# Altium project PicoBOB.PrjPCB
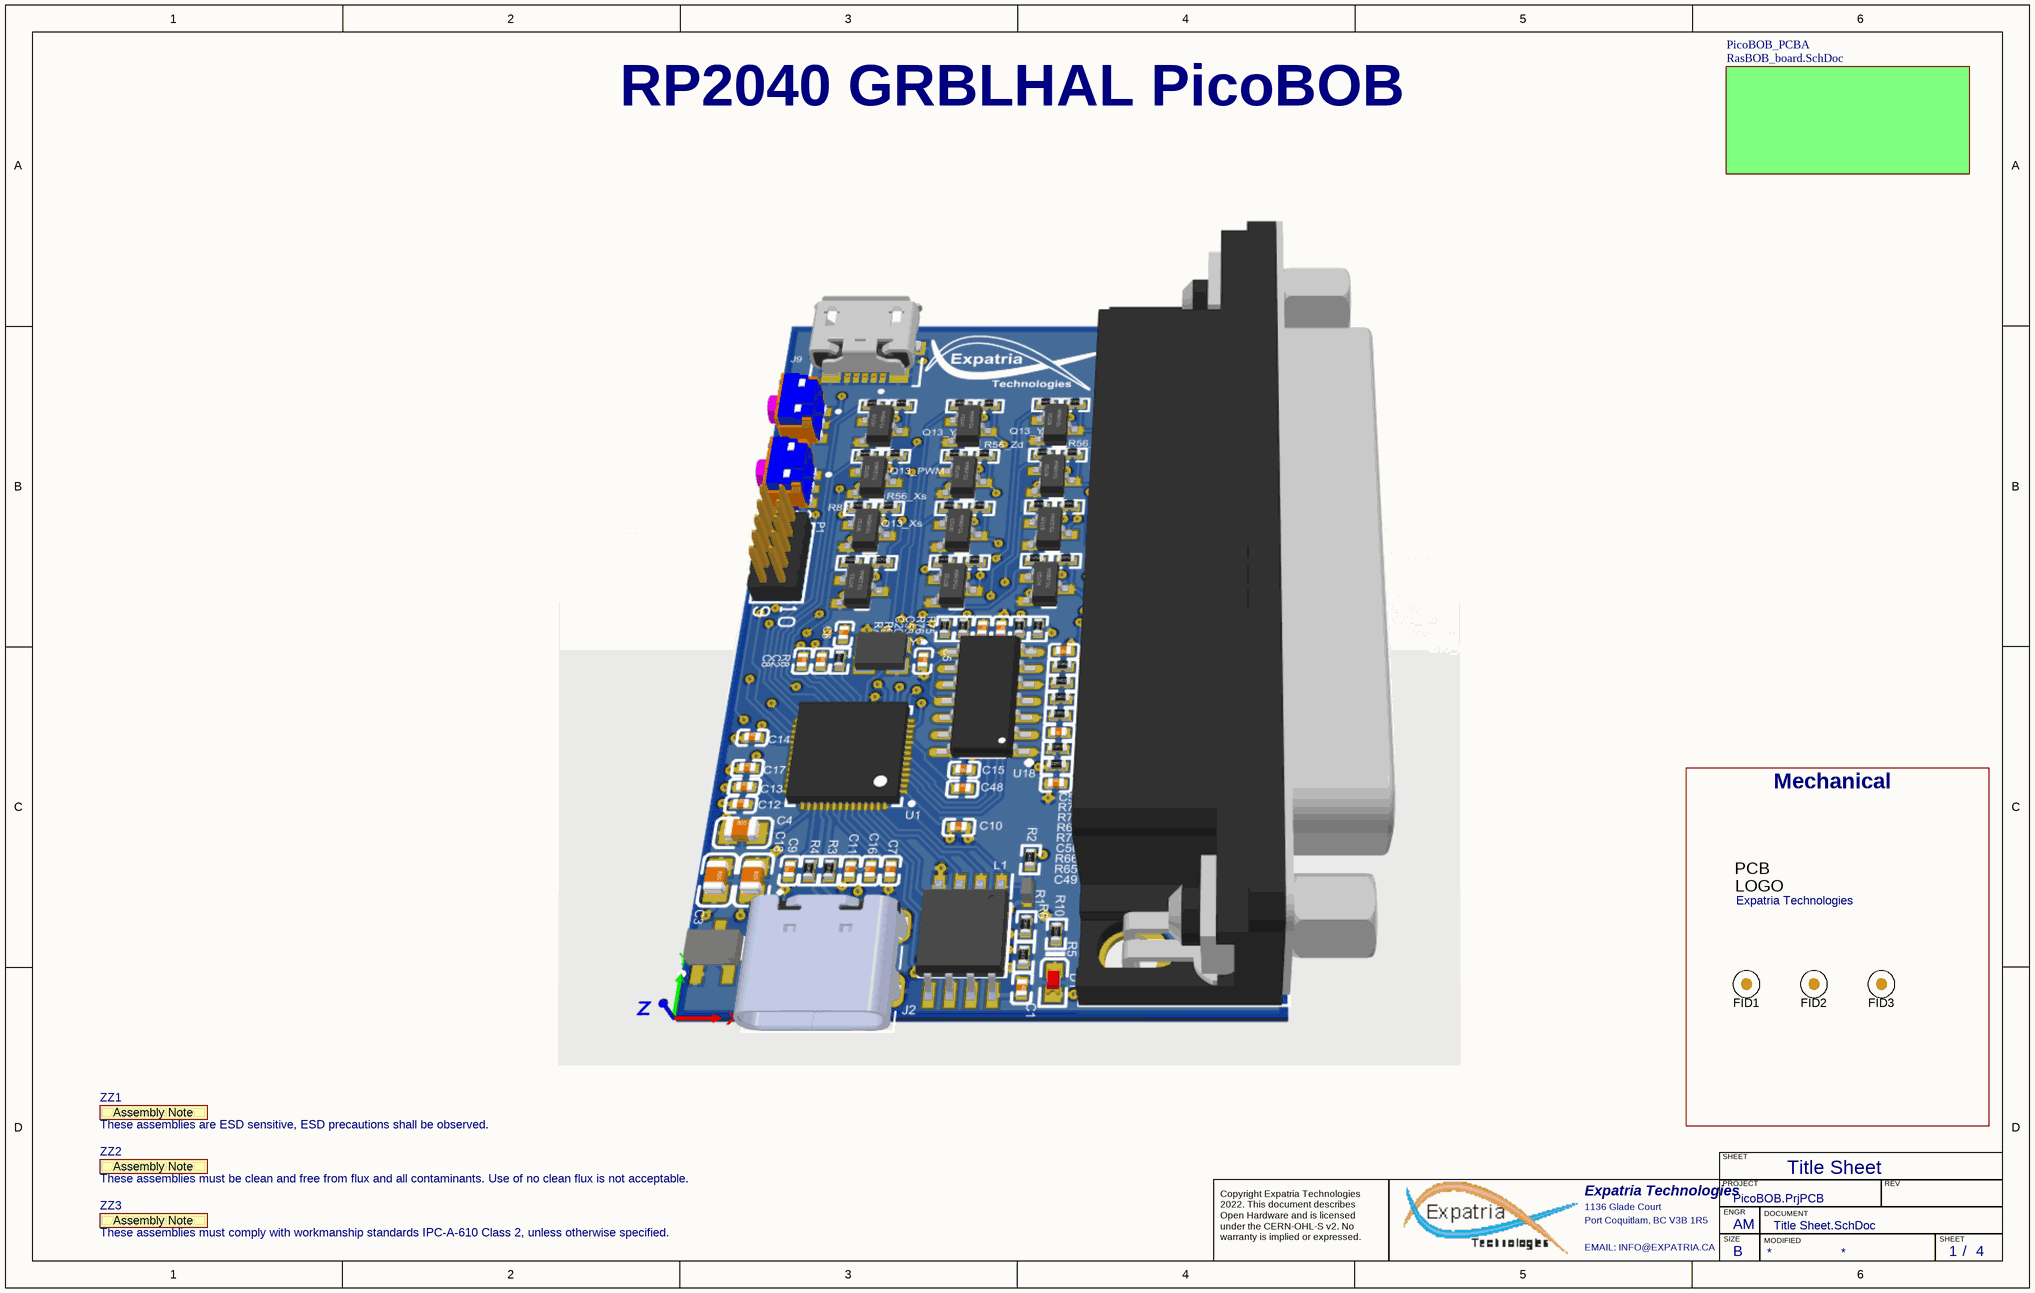
[diagram p0: Title Sheet.SchDoc]
VarRevNo: B2; Title: PicoBOB; PCBREVNO: B2; PCBPARTNO: PicoBOB
4 sheets, 97 parts. Net scope: hierarchical (ports join the sheet entries above them; power ports are global).
Board file: RasBOB_board.pcbdoc
Sheets:
  Title Sheet.SchDoc
    PicoBOB_PCBA = RasBOB_board.SchDoc
      PWM = 5V_Output_shift.SchDoc
      EN = 5V_Output_shift.SchDoc
      Xs = 5V_Output_shift.SchDoc
      Xd = 5V_Output_shift.SchDoc
      Ys = 5V_Output_shift.SchDoc
      Yd = 5V_Output_shift.SchDoc
      Zs = 5V_Output_shift.SchDoc
      Zd = 5V_Output_shift.SchDoc
      As = 5V_Output_shift.SchDoc
      Ad = 5V_Output_shift.SchDoc
      Bs = 5V_Output_shift.SchDoc
      Bd = 5V_Output_shift.SchDoc
      MCU = RP2040_MCU.SchDoc

## Sheet Title Sheet.SchDoc: RP2040 CNC
size B; Author: AM; CompanyName: Expatria Technologies; DrawnBy: A.Marles; Engineer: AM; Organization: Expatria Technolgoies; Address1: Schematic; DocumentNumber: 1; Revision: B2; SheetNumber: 1; SheetTotal: 4

### Parts
FID1  Fiducial  [Fiducial10-20]  (value not drawn)  (no BOM)
FID2  Fiducial  [Fiducial10-20]  (value not drawn)  (no BOM)
FID3  Fiducial  [Fiducial10-20]  (value not drawn)  (no BOM)
Logo1  Expatria Technologies  [Expatria-Logo]  (no BOM)
ZZ1  These assemblies are ESD sensitive, ESD precautions shall be observed.  [AssemblyNote]  (graphical)
ZZ2  These assemblies must be clean and free from flux and all contaminants. Use of no clean flux is not acceptable.  [AssemblyNote]  (graphical)
ZZ3  These assemblies must comply with workmanship standards IPC-A-610 Class 2, unless otherwise specified.  [AssemblyNote]  (graphical)

### Blocks framed on the sheet
Mechanical: FID1-FID3 Logo1

### Sub-sheets
PicoBOB_PCBA = RasBOB_board.SchDoc: no entries

### Notes on the sheet
- RP2040 GRBLHAL PicoBOB
- Title Sheet
- SHEET
- Expatria Technologies
- 1136 Glade Court
- Port Coquitlam, BC V3B 1R5
- PROJECT
- SIZE
- ENGR
- MODIFIED
- DOCUMENT
- REV
- Copyright Expatria Technologies 2022. This document describes Open Hardware and is licensed under the CERN-OHL-S v2. No warranty is implied or expressed.
- EMAIL: INFO@EXPATRIA.CA
- B
- /
- (in symbol AssemblyNote) Assembly Note
- (in symbol SBT-Logo) PCB; LOGO

### Library data of the parts
FID1-FID3 = Fiducial: FIDUCIAL NO ASSEMBLY; Manufacturer 1: NONE; Manufacturer Part Number 1: NONE; Value: Fiducial
Logo1 = SBT-Logo: Manufacturer 1: NONE; Value: Expatria Logo; Manufacturer Part Number 1: NONE
ZZ1-ZZ3 = AssemblyNote: SymbolCreator: codlsc; SymbolVersion: 2010-05-18; CompType: AssemblyNote; ClassName: AssemblyNote; Publisher: Texas Instruments; LatestRevisionDate: 2012-06-14; LatestRevisionNote: Initial Version; Alternate Manufacturer: -; Alternate PartNumber: -

## Sheet RasBOB_board.SchDoc: RP2040 CNC
size C; Author: AM; CompanyName: Expatria Technologies; DrawnBy: A.Marles; Engineer: AM; Organization: Expatria Technolgoies; Address1: Schematic; DocumentNumber: 2; Revision: B2; SheetNumber: 2; SheetTotal: 4
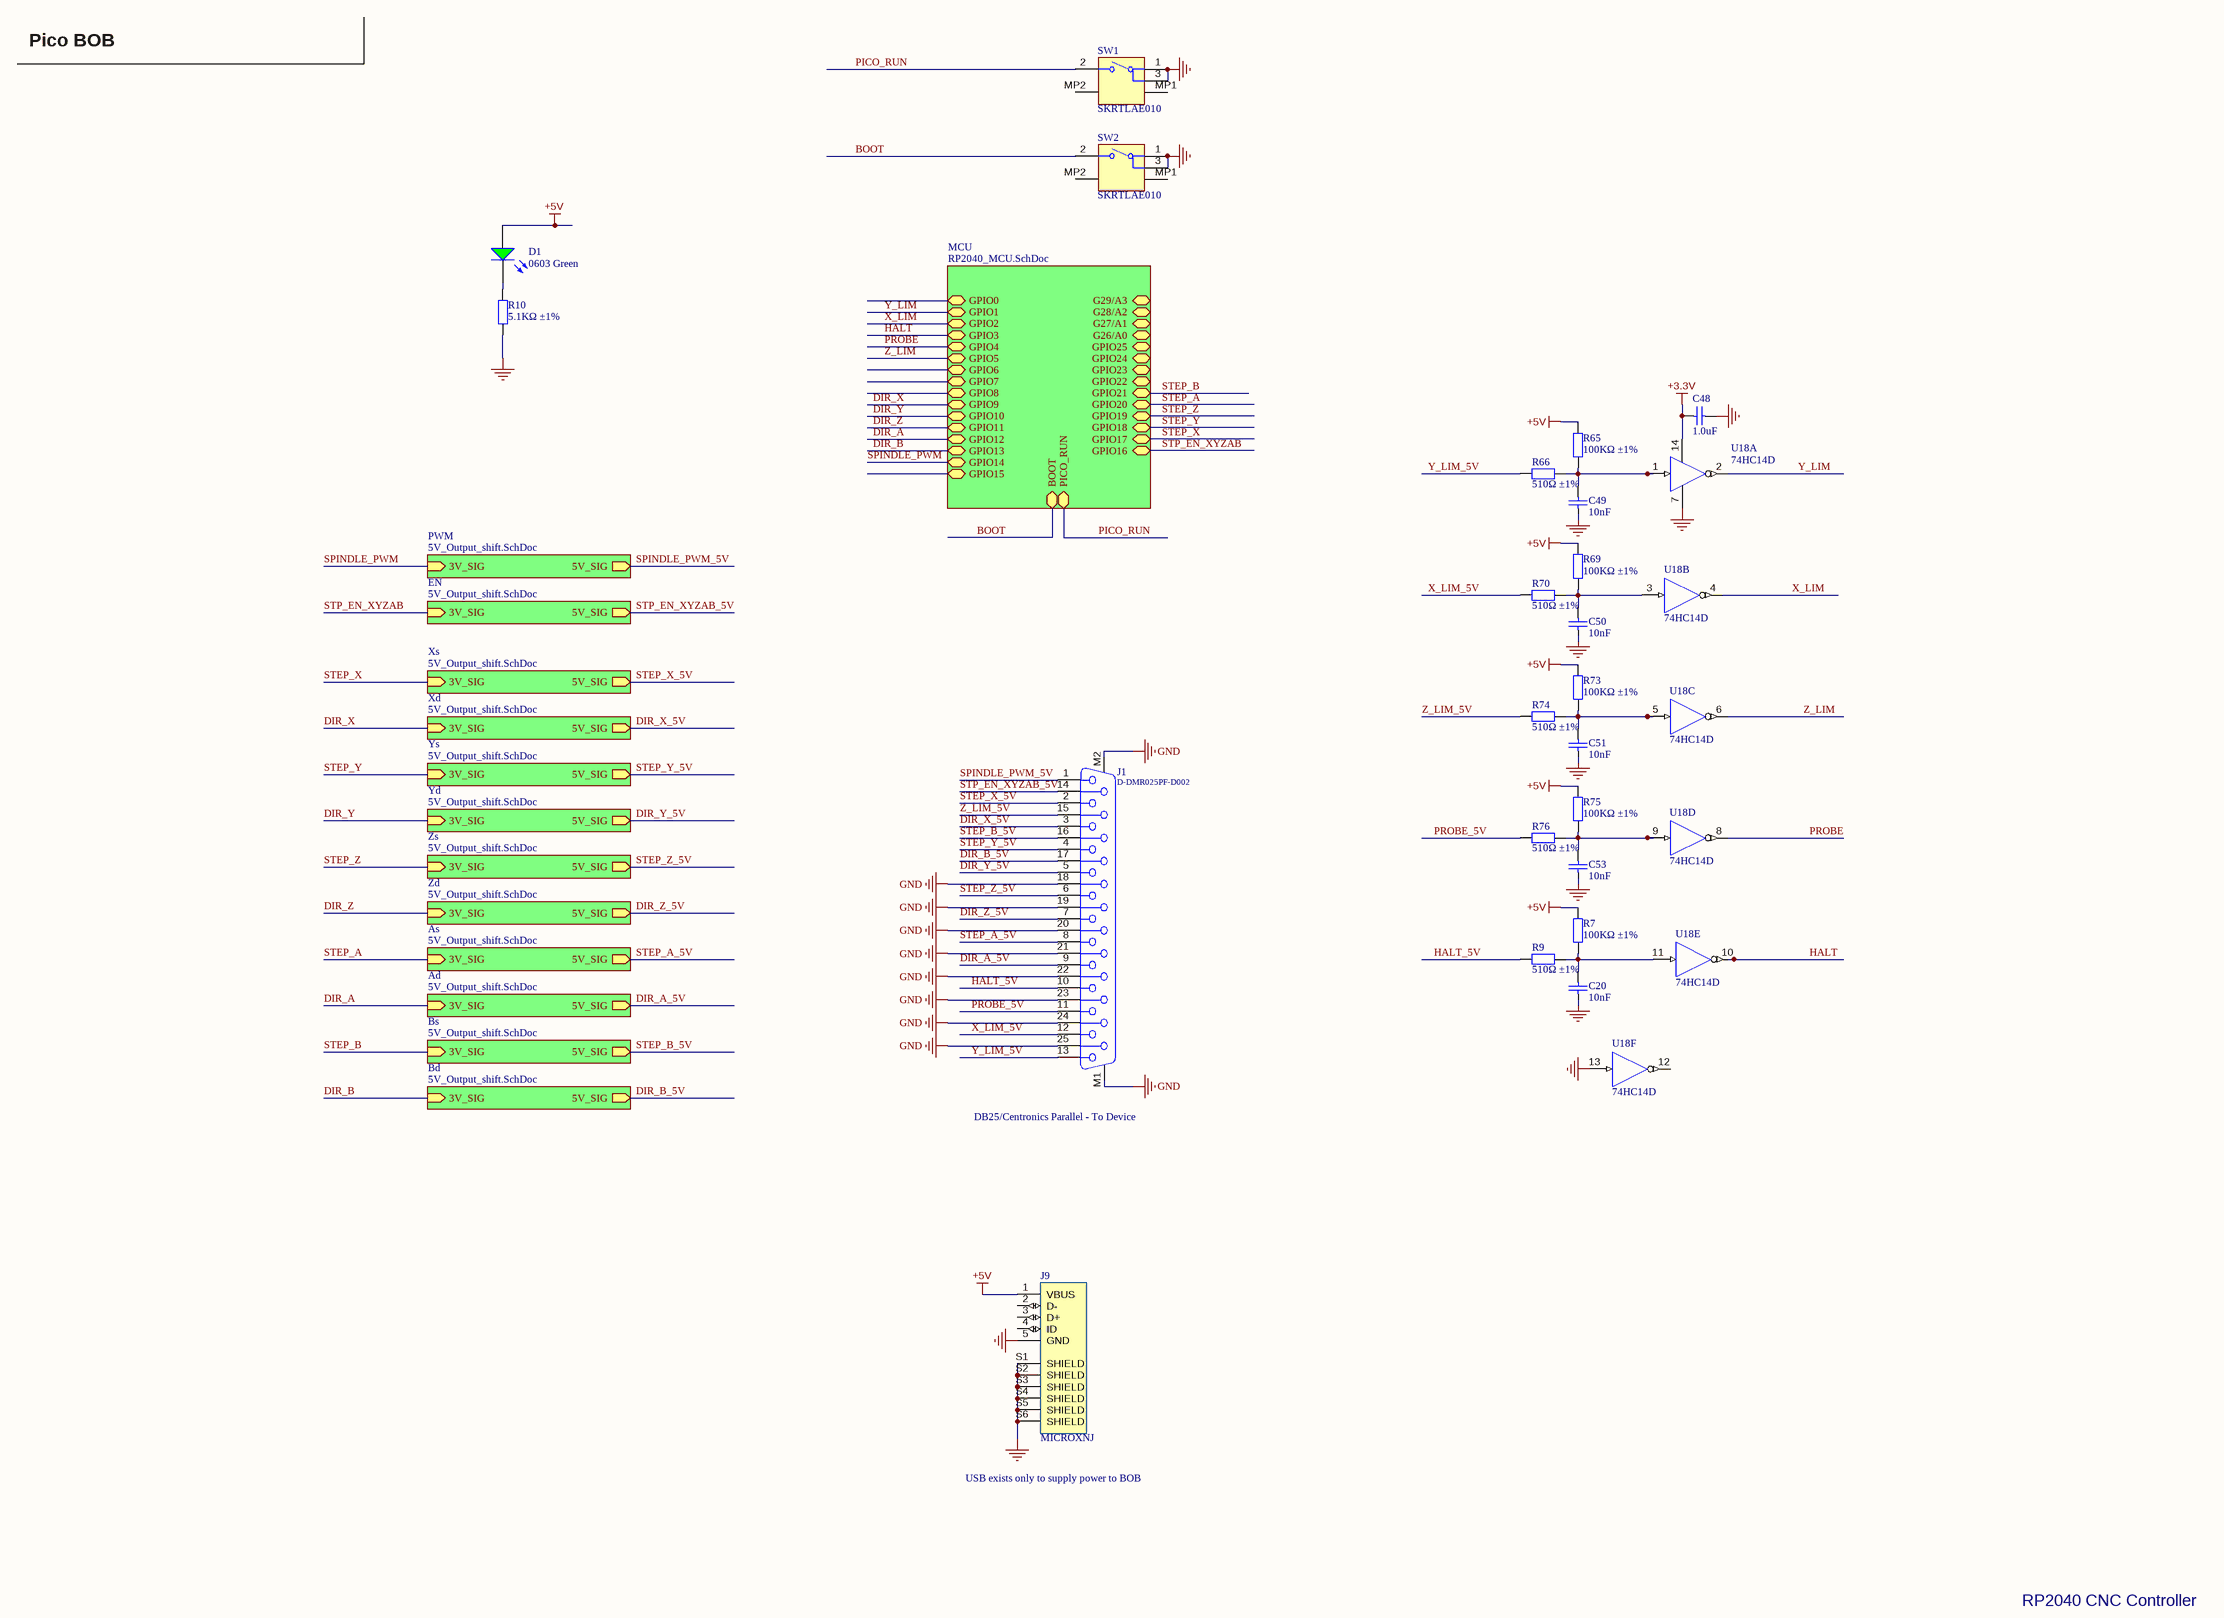
[diagram p1: RasBOB_board.SchDoc]

### Parts
C20  10nF  [0402_C]
C48  1.0uF  [0402_C]
C49  10nF  [0402_C]
C50  10nF  [0402_C]
C51  10nF  [0402_C]
C53  10nF  [0402_C]
D1  0603 Green  [0603_LED_S1]
J1  D-DMR025PF-D002  [618025231121]
J9  MICROXNJ  [SHOUHAN_MICROXNJ]
R7  100KΩ ±1%  [0402_R]
R9  510Ω ±1%  [0402_R]
R10  5.1KΩ ±1%  [0402_R]
R65  100KΩ ±1%  [0402_R]
R66  510Ω ±1%  [0402_R]
R69  100KΩ ±1%  [0402_R]
R70  510Ω ±1%  [0402_R]
R73  100KΩ ±1%  [0402_R]
R74  510Ω ±1%  [0402_R]
R75  100KΩ ±1%  [0402_R]
R76  510Ω ±1%  [0402_R]
SW1  SKRTLAE010  [ALPS-SKRTLAE010_V]
SW2  SKRTLAE010  [ALPS-SKRTLAE010_V]
U18  74HC14D  [SOIC-14_150mil]  (parts A,B,C,D,E,F of 6)

### Sub-sheets
Ad = 5V_Output_shift.SchDoc: 3V_SIG (in), 5V_SIG (out)
As = 5V_Output_shift.SchDoc: 3V_SIG (in), 5V_SIG (out)
Bd = 5V_Output_shift.SchDoc: 3V_SIG (in), 5V_SIG (out)
Bs = 5V_Output_shift.SchDoc: 3V_SIG (in), 5V_SIG (out)
EN = 5V_Output_shift.SchDoc: 3V_SIG (in), 5V_SIG (out)
MCU = RP2040_MCU.SchDoc: G28/A2 (bidir), GPIO20 (bidir), GPIO14 (bidir), GPIO25 (bidir), GPIO15 (bidir), GPIO8 (bidir), GPIO1 (bidir), G27/A1 (bidir), GPIO0 (bidir), GPIO13 (bidir), G26/A0 (bidir), GPIO21 (bidir), PICO_RUN (bidir), G29/A3 (bidir), GPIO7 (bidir), GPIO6 (bidir), GPIO12 (bidir), GPIO2 (bidir), GPIO4 (bidir), GPIO17 (bidir), GPIO10 (bidir), GPIO11 (bidir), GPIO23 (bidir), GPIO22 (bidir), GPIO18 (bidir), GPIO5 (bidir), GPIO9 (bidir), GPIO3 (bidir), GPIO24 (bidir), GPIO19 (bidir), GPIO16 (bidir), BOOT (bidir)
PWM = 5V_Output_shift.SchDoc: 3V_SIG (in), 5V_SIG (out)
Xd = 5V_Output_shift.SchDoc: 3V_SIG (in), 5V_SIG (out)
Xs = 5V_Output_shift.SchDoc: 3V_SIG (in), 5V_SIG (out)
Yd = 5V_Output_shift.SchDoc: 3V_SIG (in), 5V_SIG (out)
Ys = 5V_Output_shift.SchDoc: 3V_SIG (in), 5V_SIG (out)
Zd = 5V_Output_shift.SchDoc: 3V_SIG (in), 5V_SIG (out)
Zs = 5V_Output_shift.SchDoc: 3V_SIG (in), 5V_SIG (out)

### Nets
+3.3V: C48.1 U18.14(VDD)
+5V: D1.A J9.1(VBUS) R7.2 R65.2 R69.2 R73.2 R75.2
GND: C20.1 C48.2 C49.1 C50.1 C51.1 C53.1 J1.18 J1.19 J1.20 J1.21 J1.22 J1.23 J1.24 J1.25 J1.M1 J1.M2 J9.5(GND) J9.S1(SHIELD) J9.S2(SHIELD) J9.S3(SHIELD) J9.S4(SHIELD) J9.S5(SHIELD) J9.S6(SHIELD) R10.2 SW1.1 SW1.3 SW2.1 SW2.3 U18.7(GND) U18.13(A)
BOOT: SW2.2 ; sheet MCU/BOOT
DIR_A: sheet Ad/3V_SIG, sheet MCU/GPIO12
DIR_A_5V: J1.9 ; sheet Ad/5V_SIG
DIR_B: sheet Bd/3V_SIG, sheet MCU/GPIO13
DIR_B_5V: J1.17 ; sheet Bd/5V_SIG
DIR_X: sheet Xd/3V_SIG, sheet MCU/GPIO9
DIR_X_5V: J1.3 ; sheet Xd/5V_SIG
DIR_Y: sheet Yd/3V_SIG, sheet MCU/GPIO10
DIR_Y_5V: J1.5 ; sheet Yd/5V_SIG
DIR_Z: sheet Zd/3V_SIG, sheet MCU/GPIO11
DIR_Z_5V: J1.7 ; sheet Zd/5V_SIG
HALT: U18.10(Y) ; sheet MCU/GPIO3
HALT_5V: J1.10 R9.1
PICO_RUN: SW1.2 ; sheet MCU/PICO_RUN
PROBE: U18.8(Y) ; sheet MCU/GPIO4
PROBE_5V: J1.11 R76.1
SPINDLE_PWM: sheet PWM/3V_SIG, sheet MCU/GPIO14
SPINDLE_PWM_5V: J1.1 ; sheet PWM/5V_SIG
STEP_A: sheet As/3V_SIG, sheet MCU/GPIO20
STEP_A_5V: J1.8 ; sheet As/5V_SIG
STEP_B: sheet Bs/3V_SIG, sheet MCU/GPIO21
STEP_B_5V: J1.16 ; sheet Bs/5V_SIG
STEP_X: sheet Xs/3V_SIG, sheet MCU/GPIO17
STEP_X_5V: J1.2 ; sheet Xs/5V_SIG
STEP_Y: sheet Ys/3V_SIG, sheet MCU/GPIO18
STEP_Y_5V: J1.4 ; sheet Ys/5V_SIG
STEP_Z: sheet Zs/3V_SIG, sheet MCU/GPIO19
STEP_Z_5V: J1.6 ; sheet Zs/5V_SIG
STP_EN_XYZAB: sheet EN/3V_SIG, sheet MCU/GPIO16
STP_EN_XYZAB_5V: J1.14 ; sheet EN/5V_SIG
X_LIM: U18.4(Y) ; sheet MCU/GPIO2
X_LIM_5V: J1.12 R70.1
Y_LIM: U18.2(Y) ; sheet MCU/GPIO1
Y_LIM_5V: J1.13 R66.1
Z_LIM: U18.6(Y) ; sheet MCU/GPIO5
Z_LIM_5V: J1.15 R74.1
NetC20_2: C20.2 R7.1 R9.2 U18.11(A)
NetC49_2: C49.2 R65.1 R66.2 U18.1(A)
NetC50_2: C50.2 R69.1 R70.2 U18.3(A)
NetC51_2: C51.2 R73.1 R74.2 U18.5(A)
NetC53_2: C53.2 R75.1 R76.2 U18.9(A)
NetD1_K: D1.K R10.1

Not connected (* = marked no-connect by the designer): J9 2(D-) 3(D+) 4(ID); SW1 MP1 MP2; SW2 MP1 MP2; U18 12(Y)

### Notes on the sheet
- Pico BOB
- DB25/Centronics Parallel - To Device
- USB exists only to supply power to BOB
- RP2040 CNC Controller
- Expatria Technologies
- SHEET
- PROJECT
- REV
- 1136 Glade Court
- Port Coquitlam, BC V3B 1R5
- EMAIL: INFO@EXPATRIA.CA
- SIZE
- ENGR
- C
- MODIFIED
- DOCUMENT
- /
- Copyright Expatria Technologies 2022. This document describes Open Hardware and is licensed under the CERN-OHL-S v2. No warranty is implied or expressed.

### Library data of the parts
C20 C49-C51 C53 = 0402 10nF (103) 10% 50V: Chip capacitors; Manufacturer: Samsung Electro-Mechanics; PartNumber: CL05B103KB5NNNC; Tolerance: 10%; Voltage: 50V; ComponentLink1Description: Supplier link; ComponentLink1URL: http://www.szlcsc.com/product/details_15869.html; Package: 0402; Supplier: LC; SuppliersPartNumber: C15195; Capacitance: 10nF
C48 = 0402 1.0uF (105) 10% 25V: Chip capacitor; Manufacturer: Samsung Electro-Mechanics; PartNumber: CL05A105KA5NQNC; Capacitance: 1uF; Tolerance: 10%; Voltage: 25V; ComponentLink1Description: Supplier link; ComponentLink1URL: http://www.szlcsc.com/product/details_53938.html; Package: 0402; Supplier: LC; SuppliersPartNumber: C52923
D1 = 0603 LED Green: LED; ComponentLink1Description: 供应商链接; ComponentLink1URL: http://www.szlcsc.com/product/details_73152.html; Package: 0603; Supplier: LC; SuppliersPartNumber: C72043; Color: Green
J1 = CMP-1502-00202-1: Through Hole,P=2.77mm D-Sub Connectors ROHS; SuppliersPartNumber: C190083; PartNumber: D-DMR025PF-D002
J9 = MICROXNJ: Micro USB; MF: Shouhan; Package: Package; SuppliersPartNumber: C404969; Check_prices: https://www.snapeda.com/parts/MICROXNJ/Shouhan/view-part/5703693/?ref=eda; Price: None; SnapEDA_Link: https://www.snapeda.com/parts/MICROXNJ/Shouhan/view-part/5703693/?ref=snap; Availability: Unavailable; MP: MICROXNJ; Value: *
R7 R65 R69 R73 R75 = 0402 100K (1003) 1%: Chip resistor; Manufacturer: Uniroyal Elec; PartNumber: 0402WGF1003TCE; Power: 1/16W; ComponentLink1Description: Supplier link; ComponentLink1URL: http://www.szlcsc.com/product/details_26484.html; Package: 0402; Supplier: LC; SuppliersPartNumber: C25741; Resistance: 100KΩ; Tolerance: 1%
R9 R66 R70 R74 R76 = 0402 510R (5100) 1%: Chip resistor; Manufacturer: Uniroyal Elec; PartNumber: 0402WGF5100TCE; Power: 1/16W; ComponentLink1Description: Supplier link; ComponentLink1URL: http://www.szlcsc.com/product/details_25866.html; Package: 0402; Supplier: LC; SuppliersPartNumber: C25123; Resistance: 510Ω; Tolerance: 1%
R10 = 0402 5.1K (5101) 1%: Chip resistor; Manufacturer: Uniroyal Elec; PartNumber: 0402WGF5101TCE; Power: 1/16W; Resistance: 51.1KΩ; ComponentLink1Description: Supplier link; ComponentLink1URL: http://www.szlcsc.com/product/details_26648.html; Package: 0402; Supplier: LC; SuppliersPartNumber: C25905; Tolerance: 1%
SW1 SW2 = CMP-2000-07073-2: Side Push Type, 250 V, -40 to 90 degC, 3-Pin SMD, RoHS, Tape and Reel; Manufacturer: ALPS; Operating Force: 1.6N; Folder: Unified Components\Components\New Releases\New\; Maximum Current Rating: 0.05@12VDCA; RevisionId: 1; Pole Throw Configuration: SPST; Switch Configuration: N.O.; AccessRights: 2147483647; Maximum DC Voltage Rating: 12V; ContentType: Unified Component; Rad Hard: No; Mounting: SurfaceMount; Datasheet URL: http://www.alps.com/prod/info/E/PDF/Tact/SurfaceMount/SKRT/SKRT.PDF; Manufacturer URL: http://www.alps.com/e/; ReleaseDate: 22/09/2017 06:13:25 AM; ItemHRID: CMP-2000-07073; ContentTypeGUID: CB3C11C4-E317-11DF-B822-12313F0024A2; LifeCycle: Released; ItemGUID: EAC55BEC-37DC-4BDB-8BA7-D75E6D5C3D75; Packaging: Tape&Reel; Package Reference: SKRTLAE010; FolderGUID: B7F4506A-9127-42E7-A087-46FE7B18D116; Datasheet Version: 06/2015; Mounting Technology: SurfaceMount; LifeCycleStateGUID: 61E382EE-6656-4F12-9E24-BE9327104A25; Package Description: 3-Pin Surface Mount Device, Body 4.5 x 3.55 mm, Pitch 1.225 mm; SuppliersPartNumber: C110293; Manufacturer 1: ALPS
U18 = 74HC14D_[C5605]: 74系列逻辑芯片; ComponentLink1Description: 供应商链接; ComponentLink1URL: http://www.szlcsc.com/product/details_6056.html; Package: SOIC-14_150mil; Supplier: LC; SuppliersPartNumber: C5605

## Sheet 5V_Output_shift.SchDoc: RP2040 CNC
size B; Author: AM; CompanyName: Expatria Technologies; DrawnBy: A.Marles; Engineer: AM; Organization: Expatria Technolgoies; DocumentNumber: 4; Revision: B2; SheetNumber: 4; SheetTotal: 4
Used 12 times, as channels PicoBOB_PCBA/PWM, PicoBOB_PCBA/EN, PicoBOB_PCBA/Xs, PicoBOB_PCBA/Xd, PicoBOB_PCBA/Ys, PicoBOB_PCBA/Yd, PicoBOB_PCBA/Zs, PicoBOB_PCBA/Zd, PicoBOB_PCBA/As, PicoBOB_PCBA/Ad, PicoBOB_PCBA/Bs, PicoBOB_PCBA/Bd. Parts and nets are listed once, with the designators drawn on the sheet.
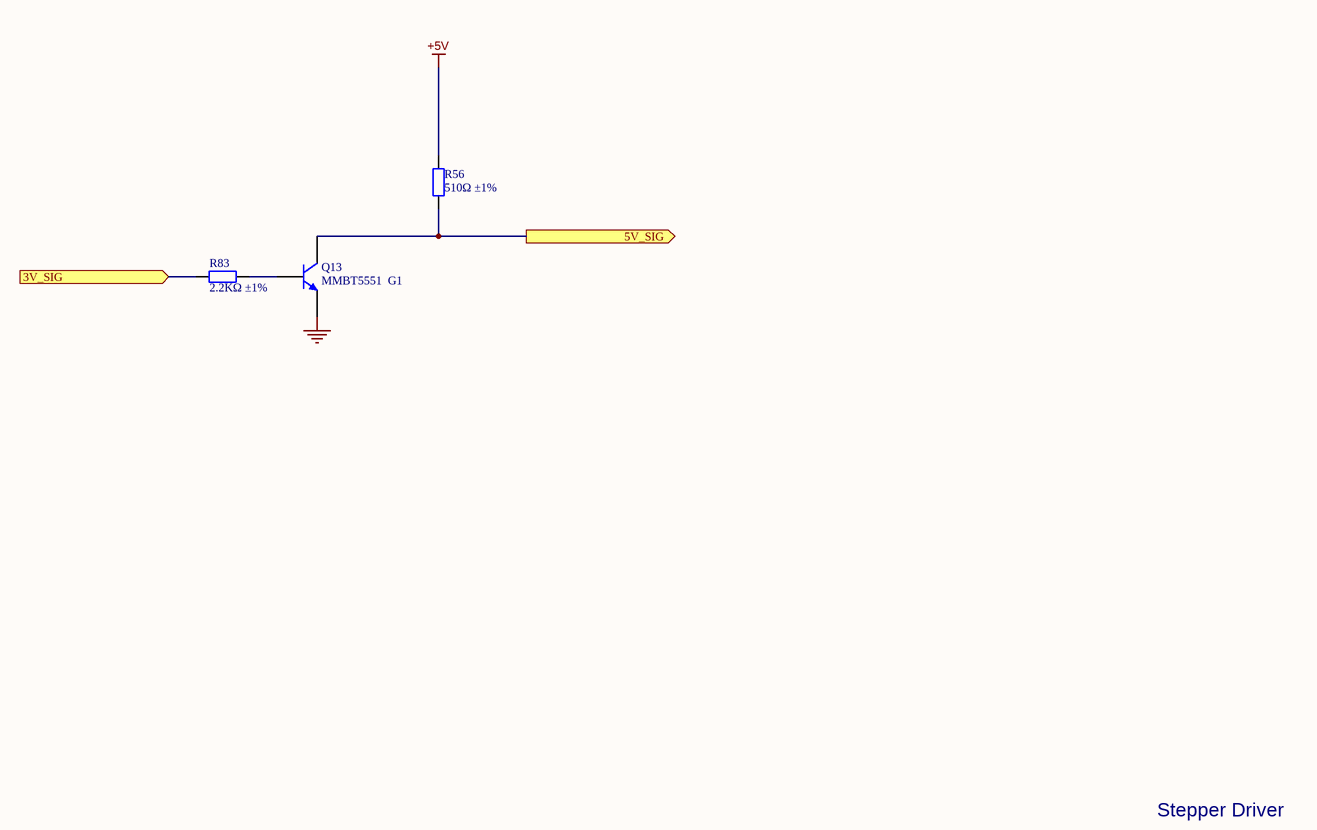
[diagram p2: 5V_Output_shift.SchDoc]

### Parts
Q13  MMBT5551  G1  [SOT-23(SOT-23-3)]
R56  510Ω ±1%  [0402_R]
R83  2.2KΩ ±1%  [0402_R]

### Ports
3V_SIG (in), 5V_SIG (out)

### Nets
+5V: R56.2
GND: Q13.2(E)
3V_SIG: R83.1 ; port 3V_SIG
5V_SIG: Q13.3(C) R56.1 ; port 5V_SIG
NetQ13_1: Q13.1(B) R83.2

### Channels
PicoBOB_PCBA/PWM: designators end in _PWM; ports 3V_SIG=SPINDLE_PWM 5V_SIG=SPINDLE_PWM_5V
PicoBOB_PCBA/EN: designators end in _EN; ports 3V_SIG=STP_EN_XYZAB 5V_SIG=STP_EN_XYZAB_5V
PicoBOB_PCBA/Xs: designators end in _Xs; ports 3V_SIG=STEP_X 5V_SIG=STEP_X_5V
PicoBOB_PCBA/Xd: designators end in _Xd; ports 3V_SIG=DIR_X 5V_SIG=DIR_X_5V
PicoBOB_PCBA/Ys: designators end in _Ys; ports 3V_SIG=STEP_Y 5V_SIG=STEP_Y_5V
PicoBOB_PCBA/Yd: designators end in _Yd; ports 3V_SIG=DIR_Y 5V_SIG=DIR_Y_5V
PicoBOB_PCBA/Zs: designators end in _Zs; ports 3V_SIG=STEP_Z 5V_SIG=STEP_Z_5V
PicoBOB_PCBA/Zd: designators end in _Zd; ports 3V_SIG=DIR_Z 5V_SIG=DIR_Z_5V
PicoBOB_PCBA/As: designators end in _As; ports 3V_SIG=STEP_A 5V_SIG=STEP_A_5V
PicoBOB_PCBA/Ad: designators end in _Ad; ports 3V_SIG=DIR_A 5V_SIG=DIR_A_5V
PicoBOB_PCBA/Bs: designators end in _Bs; ports 3V_SIG=STEP_B 5V_SIG=STEP_B_5V
PicoBOB_PCBA/Bd: designators end in _Bd; ports 3V_SIG=DIR_B 5V_SIG=DIR_B_5V

### Notes on the sheet
- Stepper Driver
- SHEET
- Expatria Technologies
- 1136 Glade Court
- Port Coquitlam, BC V3B 1R5
- PROJECT
- SIZE
- ENGR
- MODIFIED
- DOCUMENT
- REV
- Copyright Expatria Technologies 2022. This document describes Open Hardware and is licensed under the CERN-OHL-S v2. No warranty is implied or expressed.
- EMAIL: INFO@EXPATRIA.CA
- B
- /

### Library data of the parts
Q13 = SOT-23 MMBT5551  G1: 三极管; ComponentLink1Description: 供应商链接; ComponentLink1URL: http://www.szlcsc.com/product/details_2502.html; Package: SOT-23; Supplier: LC; SuppliersPartNumber: C2145
R56 = 0402 510R (5100) 1%: as R9 on sheet RasBOB_board; ComponentLink1Description: Supplier link; ComponentLink1URL: http://www.szlcsc.com/product/details_25866.html; Package: 0402; Supplier: LC; SuppliersPartNumber: C25123; Resistance: 510Ω; Tolerance: 1%
R83 = 0402 2.2K (2201) 1%: Chip resistor; Manufacturer: Uniroyal Elec; PartNumber: 0402WGF2201TCE; Power: 1/16W; ComponentLink1Description: Supplier link; ComponentLink1URL: http://www.szlcsc.com/product/details_26622.html; Package: 0402; Supplier: LC; SuppliersPartNumber: C25879; Resistance: 2.2KΩ; Tolerance: 1%

## Sheet RP2040_MCU.SchDoc: RP2040 CNC
size B; Author: AM; CompanyName: Expatria Technologies; DrawnBy: A.Marles; Engineer: AM; Organization: Expatria Technolgoies; Address1: Schematic; DocumentNumber: 3; Revision: B2; SheetNumber: 3; SheetTotal: 4
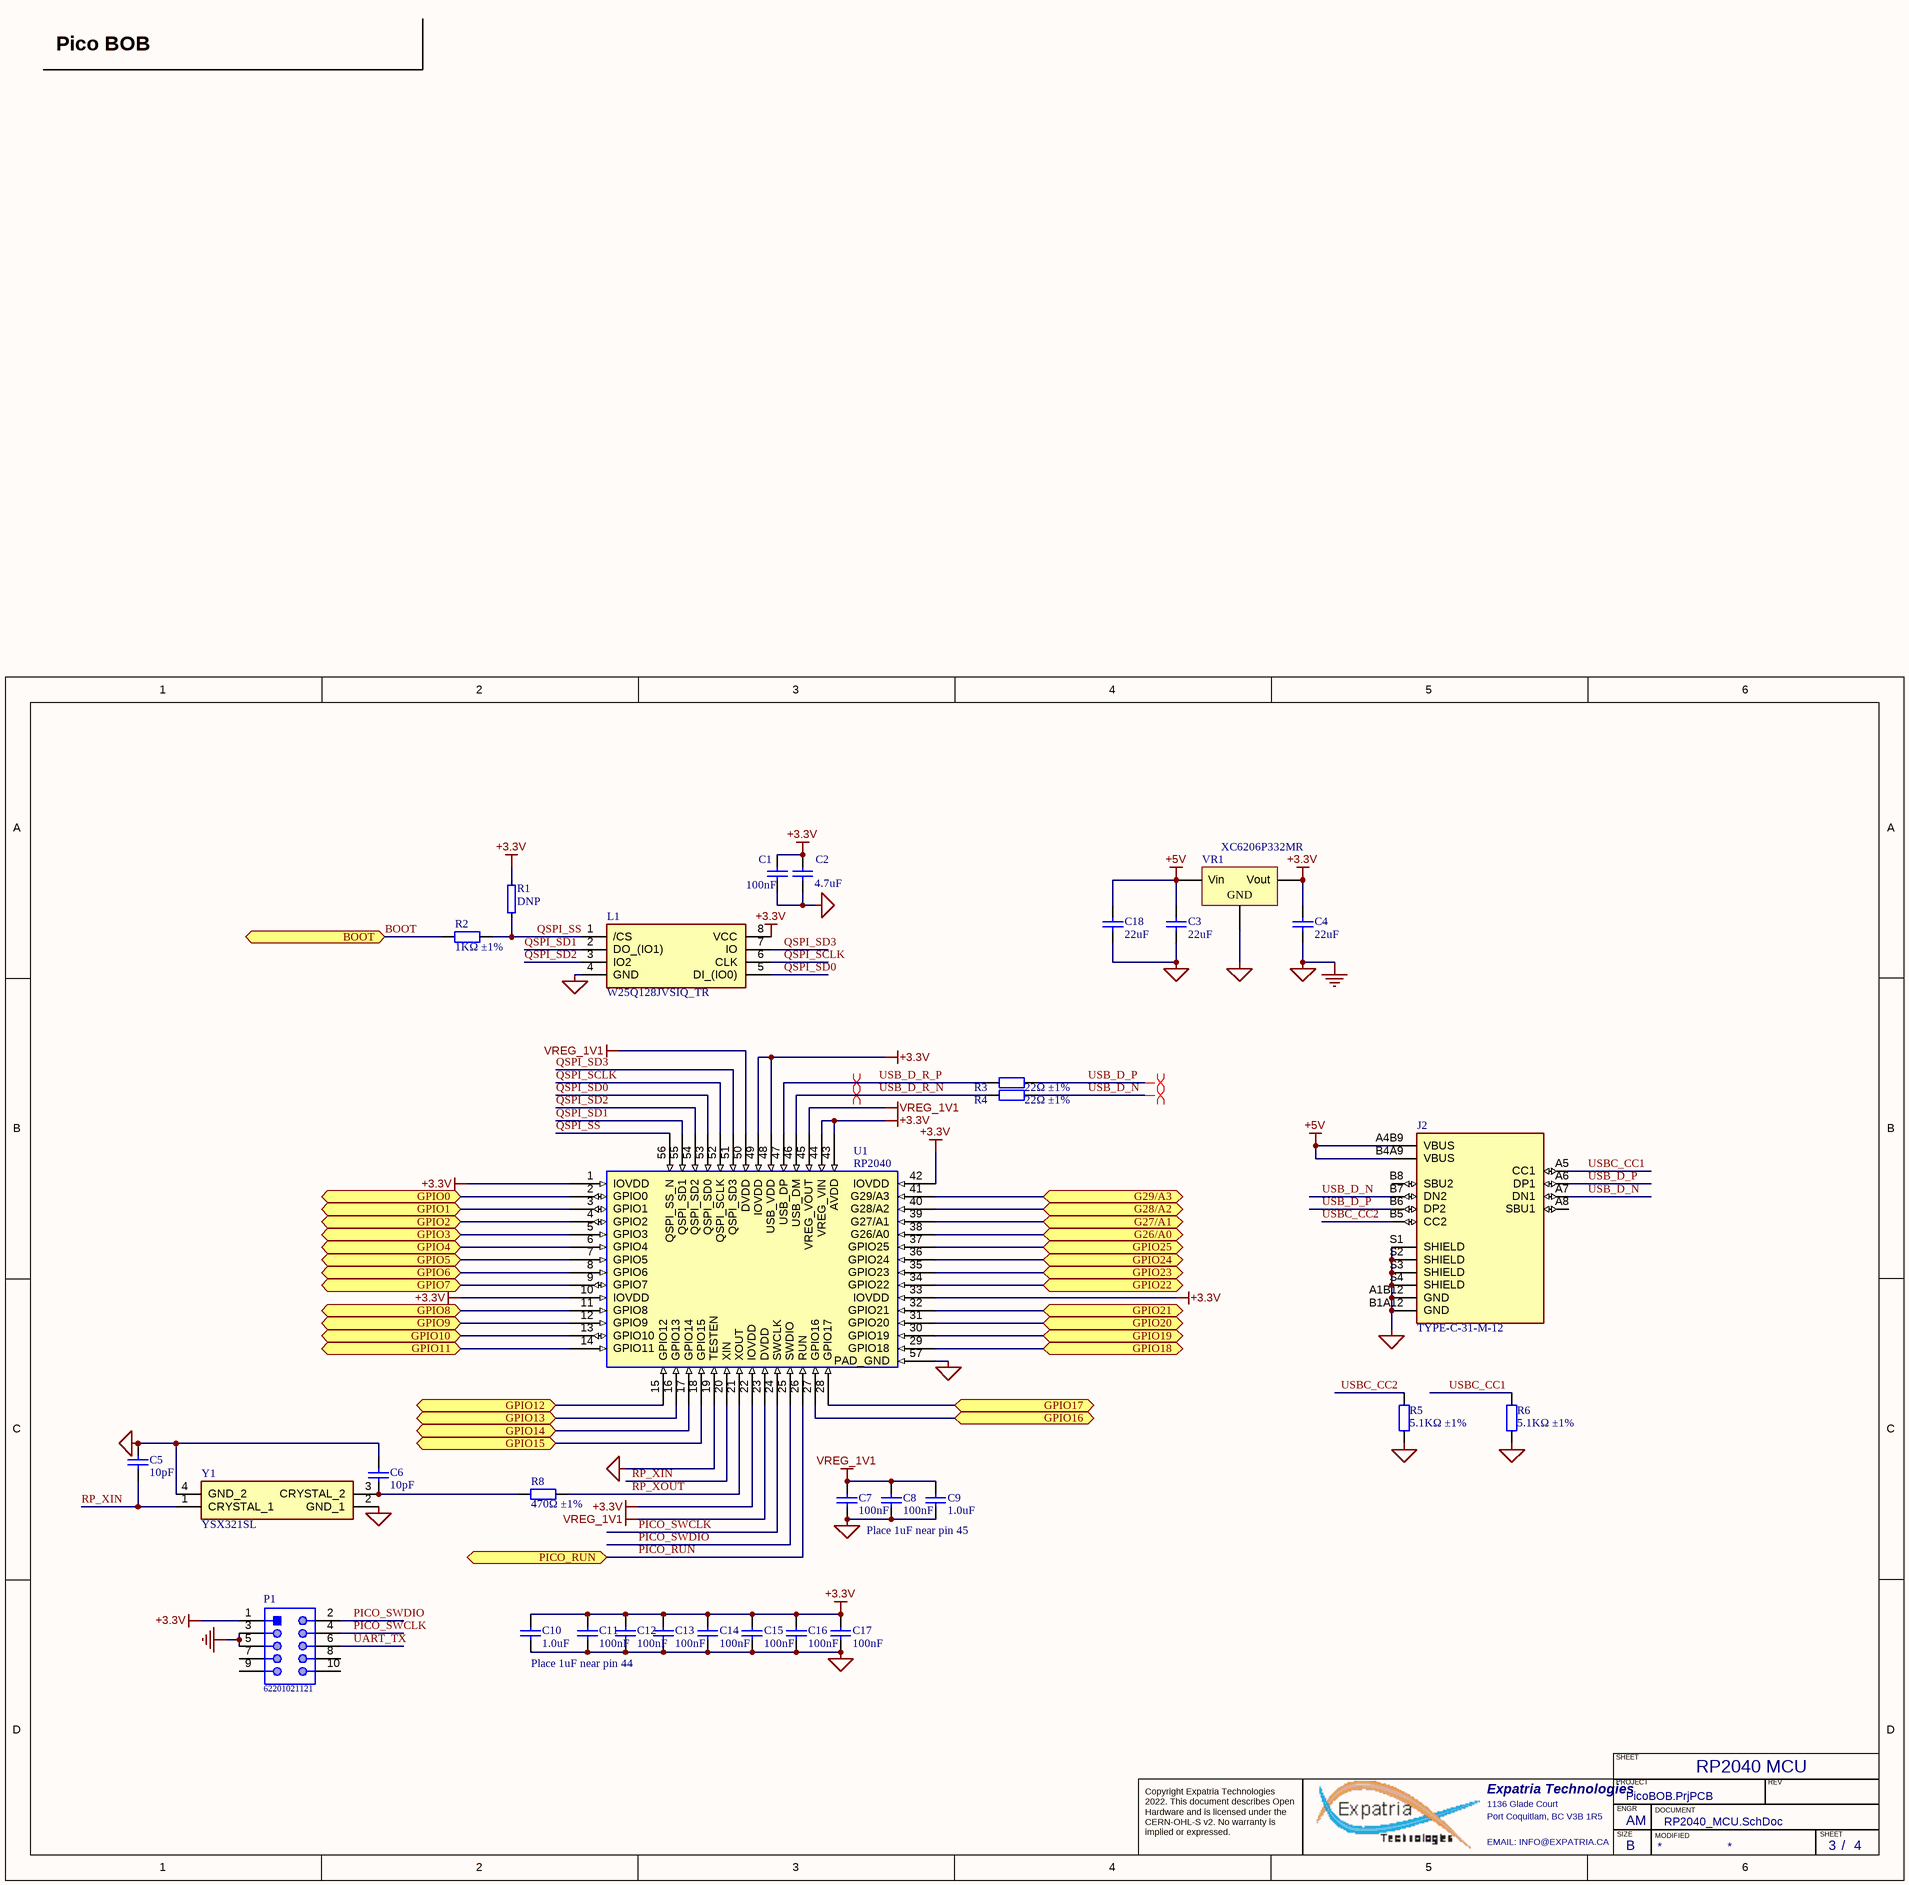
[diagram p3: RP2040_MCU.SchDoc]

### Parts
C1  100nF  [0402_C]
C2  4.7uF  [0402_C]
C3  22uF  [0805_C]
C4  22uF  [0805_C]
C5  10pF  [0402_C]
C6  10pF  [0402_C]
C7  100nF  [0402_C]
C8  100nF  [0402_C]
C9  1.0uF  [0402_C]
C10  1.0uF  [0402_C]
C11  100nF  [0402_C]
C12  100nF  [0402_C]
C13  100nF  [0402_C]
C14  100nF  [0402_C]
C15  100nF  [0402_C]
C16  100nF  [0402_C]
C17  100nF  [0402_C]
C18  22uF  [0805_C]
J2  TYPE-C-31-M-12  [HRO_TYPE-C-31-M-12]
L1  W25Q128JVSIQ_TR  [SOIC127P780X195-8N]
P1  62201021121  [62201021121]  (no BOM)
R1  DNP  [0402]
R2  1KΩ ±1%  [0402_R]
R3  22Ω ±1%  [0402_R]
R4  22Ω ±1%  [0402_R]
R5  5.1KΩ ±1%  [0402_R]
R6  5.1KΩ ±1%  [0402_R]
R8  470Ω ±1%  [0402_R]
U1  RP2040  [RP2040]
VR1  XC6206P332MR  [SOT-23-3L]
Y1  YSX321SL  [YSX321SL]

### Ports
BOOT (bidir), G26/A0 (bidir), G27/A1 (bidir), G28/A2 (bidir), G29/A3 (bidir), GPIO0 (bidir), GPIO1 (bidir), GPIO2 (bidir), GPIO3 (bidir), GPIO4 (bidir), GPIO5 (bidir), GPIO6 (bidir), GPIO7 (bidir), GPIO8 (bidir), GPIO9 (bidir), GPIO10 (bidir), GPIO11 (bidir), GPIO12 (bidir), GPIO13 (bidir), GPIO14 (bidir), GPIO15 (bidir), GPIO16 (bidir), GPIO17 (bidir), GPIO18 (bidir), GPIO19 (bidir), GPIO20 (bidir), GPIO21 (bidir), GPIO22 (bidir), GPIO23 (bidir), GPIO24 (bidir), GPIO25 (bidir), PICO_RUN (bidir)

### Nets
+3.3V: C1.2 C2.2 C4.2 C10.2 C11.2 C12.2 C13.2 C14.2 C15.2 C16.2 C17.2 L1.8(VCC) P1.1 R1.2 U1.1(IOVDD) U1.10(IOVDD) U1.22(IOVDD) U1.33(IOVDD) U1.42(IOVDD) U1.43(AVDD) U1.44(VREG_VIN) U1.48(USB_VDD) U1.49(IOVDD) VR1.2(Vout)
+5V: C3.2 C18.2 J2.A4B9(VBUS) J2.B4A9(VBUS) VR1.3(Vin)
GND: C1.1 C2.1 C3.1 C4.1 C5.2 C6.2 C7.1 C8.1 C9.1 C10.1 C11.1 C12.1 C13.1 C14.1 C15.1 C16.1 C17.1 C18.1 J2.A1B12(GND) J2.B1A12(GND) J2.S1(SHIELD) J2.S2(SHIELD) J2.S3(SHIELD) J2.S4(SHIELD) L1.4(GND) P1.3 P1.5 R5.2 R6.2 U1.19(TESTEN) U1.57(PAD_GND) VR1.1(GND) Y1.2(GND_1) Y1.4(GND_2)  [also labelled MCU_GND]
VREG_1V1: C7.2 C8.2 C9.2 U1.23(DVDD) U1.45(VREG_VOUT) U1.50(DVDD)
BOOT: R2.1 ; port BOOT
DIR_A: U1.15(GPIO12) ; port GPIO12
DIR_B: U1.16(GPIO13) ; port GPIO13
DIR_X: U1.12(GPIO9) ; port GPIO9
DIR_Y: U1.13(GPIO10) ; port GPIO10
DIR_Z: U1.14(GPIO11) ; port GPIO11
G26/A0: U1.38(G26/A0) ; port G26/A0
G27/A1: U1.39(G27/A1) ; port G27/A1
G28/A2: U1.40(G28/A2) ; port G28/A2
G29/A3: U1.41(G29/A3) ; port G29/A3
GPIO0: U1.2(GPIO0) ; port GPIO0
GPIO6: U1.8(GPIO6) ; port GPIO6
GPIO7: U1.9(GPIO7) ; port GPIO7
GPIO8: U1.11(GPIO8) ; port GPIO8
GPIO15: U1.18(GPIO15) ; port GPIO15
GPIO22: U1.34(GPIO22) ; port GPIO22
GPIO23: U1.35(GPIO23) ; port GPIO23
GPIO24: U1.36(GPIO24) ; port GPIO24
GPIO25: U1.37(GPIO25) ; port GPIO25
HALT: U1.5(GPIO3) ; port GPIO3
PICO_RUN: U1.26(RUN) ; port PICO_RUN
PICO_SWCLK: P1.4 U1.24(SWCLK)
PICO_SWDIO: P1.2 U1.25(SWDIO)
PROBE: U1.6(GPIO4) ; port GPIO4
QSPI_SCLK: L1.6(CLK) U1.52(QSPI_SCLK)
QSPI_SD0: L1.5(DI_(IO0)) U1.53(QSPI_SD0)
QSPI_SD1: L1.2(DO_(IO1)) U1.55(QSPI_SD1)
QSPI_SD2: L1.3(IO2) U1.54(QSPI_SD2)
QSPI_SD3: L1.7(IO) U1.51(QSPI_SD3)
QSPI_SS: L1.1(/CS) R1.1 R2.2 U1.56(QSPI_SS_N)
RP_XIN: C5.1 U1.20(XIN) Y1.1(CRYSTAL_1)
RP_XOUT: R8.2 U1.21(XOUT)
SPINDLE_PWM: U1.17(GPIO14) ; port GPIO14
STEP_A: U1.31(GPIO20) ; port GPIO20
STEP_B: U1.32(GPIO21) ; port GPIO21
STEP_X: U1.28(GPIO17) ; port GPIO17
STEP_Y: U1.29(GPIO18) ; port GPIO18
STEP_Z: U1.30(GPIO19) ; port GPIO19
STP_EN_XYZAB: U1.27(GPIO16) ; port GPIO16
UART_TX: P1.6
USB_D_N: J2.A7(DN1) J2.B7(DN2) R4.1
USB_D_P: J2.A6(DP1) J2.B6(DP2) R3.1
USB_D_R_N: R4.2 U1.46(USB_DM)
USB_D_R_P: R3.2 U1.47(USB_DP)
USBC_CC1: J2.A5(CC1) R6.1
USBC_CC2: J2.B5(CC2) R5.1
X_LIM: U1.4(GPIO2) ; port GPIO2
Y_LIM: U1.3(GPIO1) ; port GPIO1
Z_LIM: U1.7(GPIO5) ; port GPIO5
NetC6_1: C6.1 R8.1 Y1.3(CRYSTAL_2)

Not connected (* = marked no-connect by the designer): J2 A8(SBU1) B8(SBU2); P1 7 8 9 10

### Layout directives
differential pair: USB_D_N, USB_D_P, USB_D_R_N, USB_D_R_P

### Notes on the sheet
- Pico BOB
- Place 1uF near pin 45
- Place 1uF near pin 44
- RP2040 MCU
- SHEET
- Expatria Technologies
- 1136 Glade Court
- Port Coquitlam, BC V3B 1R5
- PROJECT
- SIZE
- ENGR
- MODIFIED
- DOCUMENT
- REV
- Copyright Expatria Technologies 2022. This document describes Open Hardware and is licensed under the CERN-OHL-S v2. No warranty is implied or expressed.
- EMAIL: INFO@EXPATRIA.CA
- B
- /

### Library data of the parts
C1 C7 C8 C11-C17 = 0402 100nF (104) 10% 16V: Chip capacitors; Manufacturer: Samsung Electro-Mechanics; PartNumber: CL05B104KO5NNNC; Tolerance: 10%; Voltage: 16V; ComponentLink1Description: Supplier link; ComponentLink1URL: http://www.szlcsc.com/product/details_1877.html; Package: 0402; Supplier: LC; SuppliersPartNumber: C1525; Capacitance: 100nF
C2 = 0402 4.7uF (475) 20% 10V: Chip capacitor; Manufacturer: Samsung Electro-Mechanics; PartNumber: CL05A475MP5NRNC; Tolerance: 20%; Voltage: 10V; ComponentLink1Description: Supplier link; ComponentLink1URL: http://www.szlcsc.com/product/details_24469.html; Package: 0402; Supplier: LC; SuppliersPartNumber: C23733; Capacitance: 4.7uF
C3 C4 C18 = 0805 22uF (226) 20% 25V: Chip capacitors; Manufacturer: Samsung Electro-Mechanics; PartNumber: CL21A226MAQNNNE; Tolerance: 20%; Voltage: 25V; Package: 0805; Supplier: LC; SuppliersPartNumber: C2922481; Capacitance: 22uF; ComponentLink1Description: Supplier link; ComponentLink1URL: http://www.szlcsc.com/product/details_46786.html
C5 C6 = 0402 10pF (100) 5% 50V: Chip capacitors; Manufacturer: Samsung Electro-Mechanics; PartNumber: CL05C100JB5NNNC; Tolerance: 5%; Voltage: 50V; ComponentLink1Description: Supplier link; ComponentLink1URL: http://www.szlcsc.com/product/details_33914.html; Package: 0402; Supplier: LC; SuppliersPartNumber: C32949; Capacitance: 10pF
C9 C10 = 0402 1.0uF (105) 10% 25V: as C48 on sheet RasBOB_board; ComponentLink1Description: Supplier link; ComponentLink1URL: http://www.szlcsc.com/product/details_53938.html; Package: 0402; Supplier: LC; SuppliersPartNumber: C52923
J2 = TYPE-C-31-M-12: USB Connectors 24 Receptacle 1 8.94*7.3mm RoHS; MF: HRO Electronics Co., Ltd.; Value: *; SnapEDA_Link: https://www.snapeda.com/parts/TYPE-C-31-M-12/HRO%20Electronics%20Co.,%20Ltd./view-part/3228496/?ref=snap; Package: Package; MP: TYPE-C-31-M-12; Price: None; Availability: Unavailable; SuppliersPartNumber: C165948
L1 = W25Q128JVSIQ_TR: Inductor; Manufacturer_Name: Winbond; Manufacturer_Part_Number: W25Q128JVSIQ TR; Datasheet Link: http://www.winbond.com/resource-files/w25q128jv%20spi%20revc%2011162016.pdf; Height: 1.95mm; Mouser Part Number: 454-W25Q128JVSIQTR; Mouser Price/Stock: https://www.mouser.co.uk/ProductDetail/Winbond/W25Q128JVSIQ-TR?qs=qSfuJ%252Bfl%2Fd7vTyLA9kNdGw%3D%3D; Arrow Part Number: W25Q128JVSIQ TR; Arrow Price/Stock: https://www.arrow.com/en/products/w25q128jvsiqtr/winbond-electronics?region=nac; SuppliersPartNumber: C97521
P1 = CMP-1502-00948-1: THT Vertical Pin Header WR-PHD, Pitch 1.27 mm, Dual Row, 10 pins; Manufacturer: Wurth Elektronik; Rated Current: 1A; Pin Number: 10; Working Voltage: 100VAC; Contact Resistance: 20mOhm; Withstanding Voltage: 500VAC; Pitch: 1.27mm; Gender: Male; Mounting Technology: THT; Manufacturer URL: http://www.we-online.de; Package Reference: 62201021121; Row Number: Dual; Datasheet URL: https://katalog.we-online.de/em/datasheet/62201021121.pdf; Publisher: WurthElektronik; Packaging: Box; Operating Temperature: -40to105degC; Orientation: Vertical; Part Number: 62201021121
R1 = RES: Resistor, ±5%, 0.05W; Part Number: R0201-0R; Part number IPS: 00000003245; Value: 0R; Note: Chip Res 5%; Artikkelnr Noca: N.A.; Manufacturer: *; Manufacturer Part Number: *; ComponentLink1URL: *; ComponentLink1Description: Datasheet; ComponentLink2URL: *; ComponentLink2Description: Supplier link; HelpURL: *; Footprint Doc: 0201; LatestRevisionDate: 2017-11-09; Pin Count: 2; Publisher: Nordic Semiconductor; Published: 2014-11-13; Supplier 1: *; Supplier Part Number 1: *; Supplier 2: *; Supplier Part Number 2: *
R2 = 0402 1K (1001) 1%: Chip resistor; Manufacturer: Uniroyal Elec; PartNumber: 0402WGF1001TCE; Power: 1/16W; ComponentLink1Description: Supplier link; ComponentLink1URL: http://www.szlcsc.com/product/details_12256.html; Package: 0402; Supplier: LC; SuppliersPartNumber: C11702; Resistance: 1KΩ; Tolerance: 1%
R3 R4 = 0402 22R (22R0) 1%: Chip resistor; Manufacturer: Uniroyal Elec; PartNumber: 0402WGF220JTCE; Power: 1/16W; ComponentLink1Description: Supplier link; ComponentLink1URL: http://www.szlcsc.com/product/details_25835.html; Package: 0402; Supplier: LC; SuppliersPartNumber: C25092; Resistance: 22Ω; Tolerance: 1%
R5 R6 = 0402 5.1K (5101) 1%: as R10 on sheet RasBOB_board; ComponentLink1Description: Supplier link; ComponentLink1URL: http://www.szlcsc.com/product/details_26648.html; Package: 0402; Supplier: LC; SuppliersPartNumber: C25905; Tolerance: 1%
R8 = 0402 470R (4700) 1%: Chip resistor; Manufacturer: Uniroyal Elec; PartNumber: 0402WGF4700TCE; Power: 1/16W; ComponentLink1Description: Supplier link; ComponentLink1URL: http://www.szlcsc.com/product/details_25860.html; Package: 0402; Supplier: LC; SuppliersPartNumber: C25117; Resistance: 470Ω; Tolerance: 1%
U1 = RP2040: RP2040 First MCU from RPI
VR1 = SOT-23 XC6206P332MR: 200mA 680mV@(100mA) Fixed 3.3V~3.3V Positive 1 6V SOT-23-3L Linear Voltage Regulators (LDO) ROHS; ComponentLink1Description: 供应商链接; ComponentLink1URL: http://www.szlcsc.com/product/details_5896.html; Package: SOT-23; Supplier: LC; SuppliersPartNumber: C5446
Y1 = YSX321SL: Crystal or Oscillator; Manufacturer_Name: YXC; Datasheet Link: https://datasheet.lcsc.com/szlcsc/YSX321SL-30MHZ-10PF-8PPM_C70576.pdf; Height: 0.8mm; Manufacturer_Part_Number: YSX321SL; SuppliersPartNumber: C9002

## Nets that join several sheets
+3.3V: RasBOB_board (C48.1 U18.14), RP2040_MCU (24 pins)
+5V: RasBOB_board (7 pins), PicoBOB_PCBA/PWM (R56_PWM.2), PicoBOB_PCBA/EN (R56_EN.2), PicoBOB_PCBA/Xs (R56_Xs.2), PicoBOB_PCBA/Xd (R56_Xd.2), PicoBOB_PCBA/Ys (R56_Ys.2), PicoBOB_PCBA/Yd (R56_Yd.2), PicoBOB_PCBA/Zs (R56_Zs.2), PicoBOB_PCBA/Zd (R56_Zd.2), PicoBOB_PCBA/As (R56_As.2), PicoBOB_PCBA/Ad (R56_Ad.2), PicoBOB_PCBA/Bs (R56_Bs.2), PicoBOB_PCBA/Bd (R56_Bd.2), RP2040_MCU (5 pins)
GND: RasBOB_board (30 pins), PicoBOB_PCBA/PWM (Q13_PWM.2), PicoBOB_PCBA/EN (Q13_EN.2), PicoBOB_PCBA/Xs (Q13_Xs.2), PicoBOB_PCBA/Xd (Q13_Xd.2), PicoBOB_PCBA/Ys (Q13_Ys.2), PicoBOB_PCBA/Yd (Q13_Yd.2), PicoBOB_PCBA/Zs (Q13_Zs.2), PicoBOB_PCBA/Zd (Q13_Zd.2), PicoBOB_PCBA/As (Q13_As.2), PicoBOB_PCBA/Ad (Q13_Ad.2), PicoBOB_PCBA/Bs (Q13_Bs.2), PicoBOB_PCBA/Bd (Q13_Bd.2), RP2040_MCU (34 pins)
BOOT: RasBOB_board (SW2.2), RP2040_MCU (R2.1)
DIR_A: PicoBOB_PCBA/Ad (R83_Ad.1), RP2040_MCU (U1.15)
DIR_A_5V: RasBOB_board (J1.9), PicoBOB_PCBA/Ad (Q13_Ad.3 R56_Ad.1)
DIR_B: PicoBOB_PCBA/Bd (R83_Bd.1), RP2040_MCU (U1.16)
DIR_B_5V: RasBOB_board (J1.17), PicoBOB_PCBA/Bd (Q13_Bd.3 R56_Bd.1)
DIR_X: PicoBOB_PCBA/Xd (R83_Xd.1), RP2040_MCU (U1.12)
DIR_X_5V: RasBOB_board (J1.3), PicoBOB_PCBA/Xd (Q13_Xd.3 R56_Xd.1)
DIR_Y: PicoBOB_PCBA/Yd (R83_Yd.1), RP2040_MCU (U1.13)
DIR_Y_5V: RasBOB_board (J1.5), PicoBOB_PCBA/Yd (Q13_Yd.3 R56_Yd.1)
DIR_Z: PicoBOB_PCBA/Zd (R83_Zd.1), RP2040_MCU (U1.14)
DIR_Z_5V: RasBOB_board (J1.7), PicoBOB_PCBA/Zd (Q13_Zd.3 R56_Zd.1)
HALT: RasBOB_board (U18.10), RP2040_MCU (U1.5)
PICO_RUN: RasBOB_board (SW1.2), RP2040_MCU (U1.26)
PROBE: RasBOB_board (U18.8), RP2040_MCU (U1.6)
SPINDLE_PWM: PicoBOB_PCBA/PWM (R83_PWM.1), RP2040_MCU (U1.17)
SPINDLE_PWM_5V: RasBOB_board (J1.1), PicoBOB_PCBA/PWM (Q13_PWM.3 R56_PWM.1)
STEP_A: PicoBOB_PCBA/As (R83_As.1), RP2040_MCU (U1.31)
STEP_A_5V: RasBOB_board (J1.8), PicoBOB_PCBA/As (Q13_As.3 R56_As.1)
STEP_B: PicoBOB_PCBA/Bs (R83_Bs.1), RP2040_MCU (U1.32)
STEP_B_5V: RasBOB_board (J1.16), PicoBOB_PCBA/Bs (Q13_Bs.3 R56_Bs.1)
STEP_X: PicoBOB_PCBA/Xs (R83_Xs.1), RP2040_MCU (U1.28)
STEP_X_5V: RasBOB_board (J1.2), PicoBOB_PCBA/Xs (Q13_Xs.3 R56_Xs.1)
STEP_Y: PicoBOB_PCBA/Ys (R83_Ys.1), RP2040_MCU (U1.29)
STEP_Y_5V: RasBOB_board (J1.4), PicoBOB_PCBA/Ys (Q13_Ys.3 R56_Ys.1)
STEP_Z: PicoBOB_PCBA/Zs (R83_Zs.1), RP2040_MCU (U1.30)
STEP_Z_5V: RasBOB_board (J1.6), PicoBOB_PCBA/Zs (Q13_Zs.3 R56_Zs.1)
STP_EN_XYZAB: PicoBOB_PCBA/EN (R83_EN.1), RP2040_MCU (U1.27)
STP_EN_XYZAB_5V: RasBOB_board (J1.14), PicoBOB_PCBA/EN (Q13_EN.3 R56_EN.1)
X_LIM: RasBOB_board (U18.4), RP2040_MCU (U1.4)
Y_LIM: RasBOB_board (U18.2), RP2040_MCU (U1.3)
Z_LIM: RasBOB_board (U18.6), RP2040_MCU (U1.7)

## Assembly variants
SMT_ONLY: not fitted J1_LS_A J1_LS_X J1_LS_Y J1_LS_Z J2_LS_A J2_LS_X J2_LS_Y J2_LS_Z J3_PH_CY J3_PH_DR J3_PH_FD J3_PH_HLT J3_PH_PR J5 P1 P2 P3 P4 P5 P6 P7 P8 P9 P10 P12_STP_A P12_STP_X P12_STP_Y P12_STP_Z P13 R7_LS_X
FULL_PLACE: all parts fitted